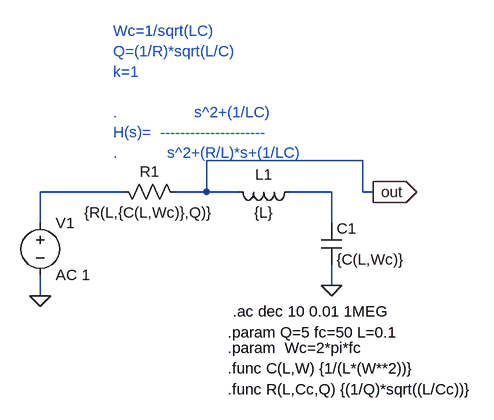
[diagram p0: schematic notch.asc]
notch.asc, the LTspice schematic file:
Version 4
SHEET 1 880 680
WIRE 320 16 80 16
WIRE -48 64 -176 64
WIRE 80 64 80 16
WIRE 80 64 32 64
WIRE 128 64 80 64
WIRE 272 64 208 64
WIRE 320 64 320 16
WIRE 336 64 320 64
WIRE -176 112 -176 64
WIRE 272 112 272 64
WIRE 272 208 272 176
WIRE -176 224 -176 192
FLAG 272 208 0
FLAG -176 224 0
FLAG 336 64 out
IOPIN 336 64 Out
SYMBOL res -64 48 M90
WINDOW 0 0 56 VBottom 2
WINDOW 3 32 56 VTop 2
SYMATTR InstName R1
SYMATTR Value {R(L,{C(L,Wc)},Q)}
SYMBOL ind 224 48 R90
WINDOW 0 5 56 VBottom 2
WINDOW 3 32 56 VTop 2
SYMATTR InstName L1
SYMATTR Value {L}
SYMBOL cap 256 176 M180
WINDOW 0 24 56 Left 2
WINDOW 3 24 8 Left 2
SYMATTR InstName C1
SYMATTR Value {C(L,Wc)}
SYMBOL voltage -176 96 R0
WINDOW 123 0 0 Left 0
WINDOW 39 0 0 Left 0
SYMATTR InstName V1
SYMATTR Value AC 1
TEXT 112 280 Left 2 !.param Q=5 fc=50 L=0.1
TEXT 112 304 Left 2 !.param  Wc=2*pi*fc
TEXT 112 336 Left 2 !.func C(L,W) {1/(L*(W**2))}
TEXT -64 -184 Left 2 ;Wc=1/sqrt(LC)\nQ=(1/R)*sqrt(L/C)\nk=1\n \n.                 s^2+(1/LC)\nH(s)=  ---------------------\n.           s^2+(R/L)*s+(1/LC)
TEXT 112 368 Left 2 !.func R(L,Cc,Q) {(1/Q)*sqrt((L/Cc))}
TEXT 120 248 Left 2 !.ac dec 10 0.01 1MEG

The netlist it stands for:
* notch.asc
R1 N001 out {R(L,{C(L,Wc)},Q)}
L1 N002 out {L}
C1 0 N002 {C(L,Wc)}
V1 N001 0 AC 1
.param Q=5 fc=50 L=0.1
.param  Wc=2*pi*fc
.func C(L,W) {1/(L*(W**2))}
* Wc=1/sqrt(LC)
* Q=(1/R)*sqrt(L/C)
* k=1
* .                 s^2+(1/LC)
* H(s)=  ---------------------
* .           s^2+(R/L)*s+(1/LC)
.func R(L,Cc,Q) {(1/Q)*sqrt((L/Cc))}
.ac dec 10 0.01 1MEG
.backanno
.end